# Altium project AATB.PrjPcb (part 1 of 2)
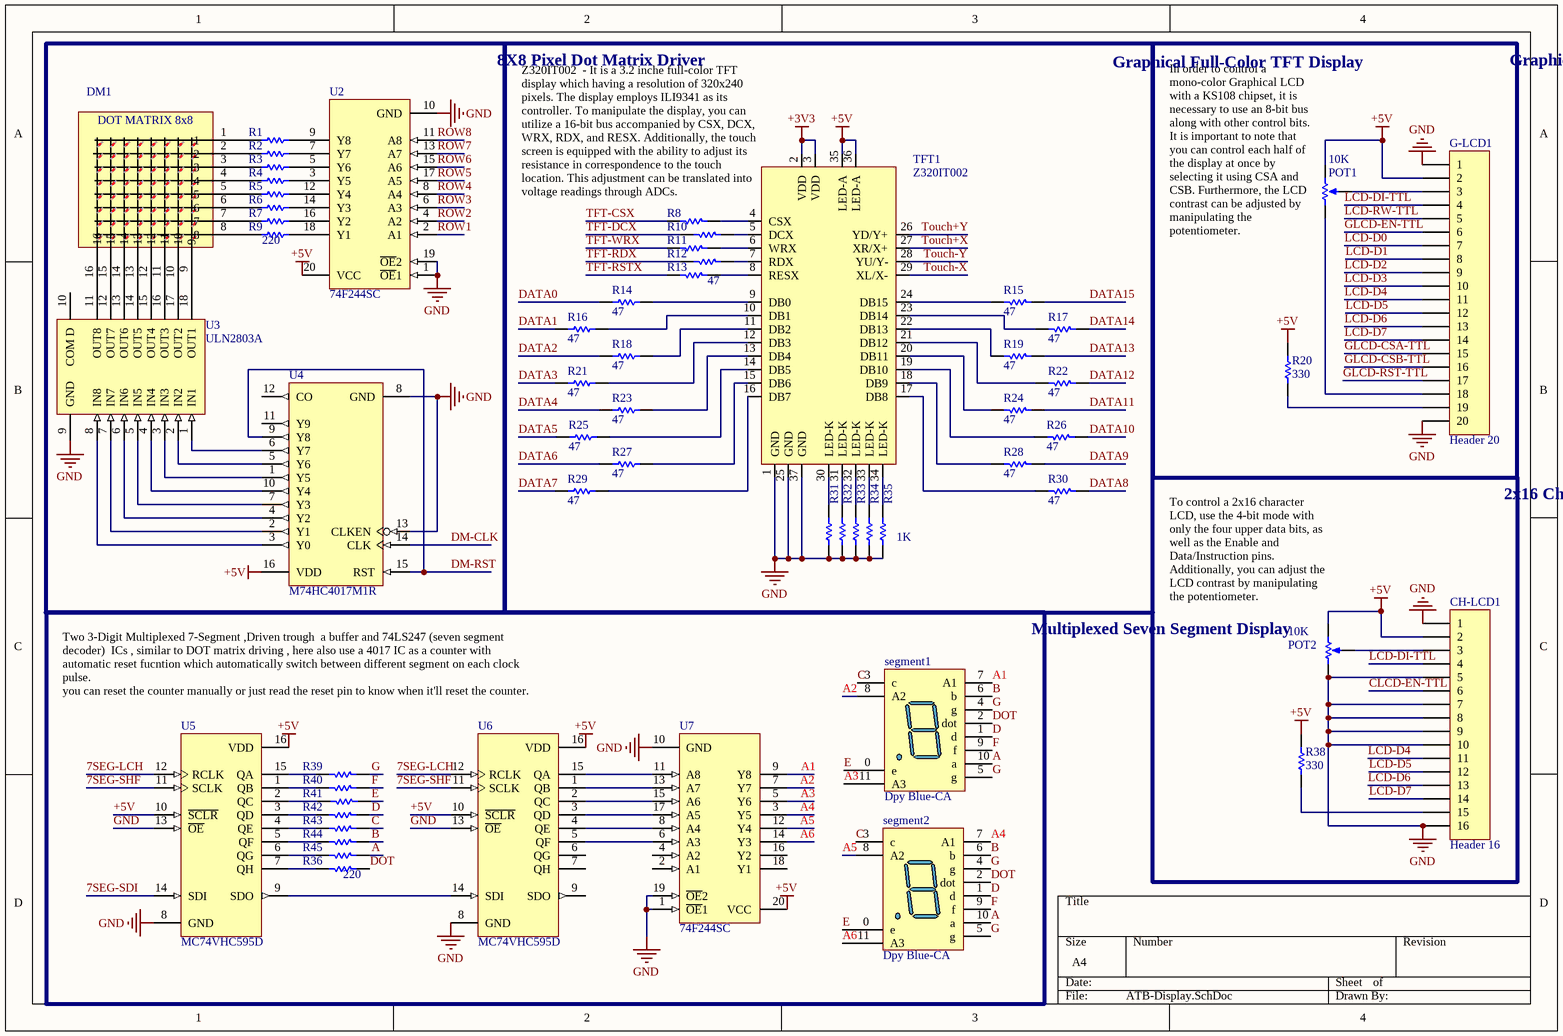
[diagram p0: ATB-Display.SchDoc]
6 sheets, 283 parts. Net scope: global (net labels, ports and power ports of the same name join across sheets).
Board file: AATB-V2.1.PcbDoc
Sheets:
  ATB-Display.SchDoc
  ATB-Power.SchDoc
  ATB-Ports.SchDoc
  ATB-Basics-PartA.SchDoc
  ATB-Basics-PartB.SchDoc
  AATB-V2.1.SchDoc

## Sheet ATB-Display.SchDoc
size A4

### Parts
(Parts that share a designator on the sheet are numbered #1, #2 ... from top to bottom, then left to right.)
CH-LCD1  Header 16  [2X16 LCD]
DM1  DOT-8x8-32X32mm  [8x8 LED MATRIX]  (value not drawn)
G-LCD1  Header 20  [LCD-128X64-ST7920]
POT1  value 10K  [VR5]  (hidden comment: RPot)
POT2  value 10K  [VR5]  (hidden comment: RPot)
R1  220  [SMD_R0805]  (value not drawn)
R2  220  [SMD_R0805]  (value not drawn)
R3  220  [SMD_R0805]  (value not drawn)
R4  220  [SMD_R0805]  (value not drawn)
R5  220  [SMD_R0805]  (value not drawn)
R6  220  [SMD_R0805]  (value not drawn)
R7  220  [SMD_R0805]  (value not drawn)
R8  47  [SMD_R0805]
R9  220  [SMD_R0805]
R10  47  [SMD_R0805]  (value not drawn)
R11  47  [SMD_R0805]  (value not drawn)
R12  47  [SMD_R0805]  (value not drawn)
R13  47  [SMD_R0805]  (value not drawn)
R14  47  [SMD_R0805]
R15  47  [SMD_R0805]
R16  47  [SMD_R0805]
R17  47  [SMD_R0805]
R18  47  [SMD_R0805]
R19  47  [SMD_R0805]
R20  330  [SMD_R1206]
R21  47  [SMD_R0805]
R22  47  [SMD_R0805]
R23  47  [SMD_R0805]
R24  47  [SMD_R0805]
R25  47  [SMD_R0805]
R26  47  [SMD_R0805]
R27  47  [SMD_R0805]
R28  47  [SMD_R0805]
R29  47  [SMD_R0805]
R30  47  [SMD_R0805]
R31  1K  [SMD_R0805]  (value not drawn)
R32  1K  [SMD_R0805]  (value not drawn)
R33  1K  [SMD_R0805]  (value not drawn)
R34  1K  [SMD_R0805]  (value not drawn)
R35  1K  [SMD_R0805]
R36  220  [SMD_R0805]  (value not drawn)
R38  330  [SMD_R1206]
R39  220  [SMD_R0805]  (value not drawn)
R40  220  [SMD_R0805]  (value not drawn)
R41  220  [SMD_R0805]  (value not drawn)
R42  220  [SMD_R0805]  (value not drawn)
R43  220  [SMD_R0805]  (value not drawn)
R44  220  [SMD_R0805]
R45#1  220  [SMD_R0805]  (value not drawn)
segment1  Dpy Blue-CA  [7 segment Diode]
segment2  Dpy Blue-CA  [7 segment Diode]
TFT1  Z320IT002  [N96 COLOR LCD]
U2  74F244SC  [751D-04_N]
U3  ULN2803A  [so18_n]
U4  M74HC4017M1R  [SO16_N]
U5  MC74VHC595D  [751B-05_N]
U6  MC74VHC595D  [751B-05_N]
U7  74F244SC  [751D-04_N]

### Blocks framed on the sheet
8X8 Pixel Dot Matrix Driver: DM1 R1-R7 R9 U2-U4
Graphical Full-Color TFT Display: R8 R10-R19 R21-R35 TFT1
Graphical Mono Color LCD: G-LCD1 POT1 R20
Multiplexed Seven Segment Display: R36 R39-R44 R45#1 segment1 segment2 U5-U7

### Nets
+3V3: TFT1.2(VDD) TFT1.3(VDD)
+5V: CH-LCD1.2 G-LCD1.2 POT1.2(BOT) POT2.2(BOT) R20.2 R38.2 TFT1.35(LED-A) TFT1.36(LED-A) U2.20(VCC) U4.16(VDD) U5.10(~{SCLR}) U5.16(VDD) U6.10(~{SCLR}) U6.16(VDD) U7.20(VCC)
GND: CH-LCD1.1 CH-LCD1.5 CH-LCD1.7 CH-LCD1.8 CH-LCD1.9 CH-LCD1.10 CH-LCD1.16 G-LCD1.1 G-LCD1.20 POT2.1(TOP) R31.2 R32.2 R33.2 R34.2 R35.2 TFT1.1(GND) TFT1.25(GND) TFT1.37(GND) U2.1(~{OE}1) U2.10(GND) U2.19(~{OE}2) U3.9(GND) U4.8(GND) U4.13(CLKEN) U5.8(GND) U5.13(~{OE}) U6.8(GND) U6.13(~{OE}) U7.1(~{OE}1) U7.10(GND) U7.19(~{OE}2)
7SEG-LCH: U5.12(RCLK) U6.12(RCLK)
7SEG-SDI: U5.14(SDI)
7SEG-SHF: U5.11(SCLK) U6.11(SCLK)
A: R45#1.1 segment1.10(a) segment2.10(a)
A1: segment1.7(A1) U7.9(Y8)
A2: segment1.8(A2) U7.7(Y7)
A3: segment1.11(A3) U7.5(Y6)
A4: segment2.7(A1) U7.3(Y5)
A5: segment2.8(A2) U7.12(Y4)
A6: segment2.11(A3) U7.14(Y3)
B: R44.2 segment1.6(b) segment2.6(b)
C: R43.2 segment1.3(c) segment2.3(c)
CLCD-EN-TTL: CH-LCD1.6
D: R42.2 segment1.1(d) segment2.1(d)
DATA0: R14.2
DATA1: R16.2
DATA2: R18.2
DATA3: R21.2
DATA4: R23.2
DATA5: R25.1
DATA6: R27.1
DATA7: R29.1
DATA8: R30.1
DATA9: R28.1
DATA10: R26.1
DATA11: R24.2
DATA12: R22.2
DATA13: R19.2
DATA14: R17.2
DATA15: R15.2
DM-CLK: U4.14(CLK)
DM-RST: U4.9(Y8) U4.15(RST)
DOT: R36.1 segment1.2(dot) segment2.2(dot)
E: R41.2 segment1.0(e) segment2.0(e)
F: R40.2 segment1.9(f) segment2.9(f)
G: R39.2 segment1.4(g) segment1.5(g) segment2.4(g) segment2.5(g)
GLCD-CSA-TTL: G-LCD1.15
GLCD-CSB-TTL: G-LCD1.16
GLCD-EN-TTL: G-LCD1.6
GLCD-RST-TTL: G-LCD1.17
LCD-D0: G-LCD1.7
LCD-D1: G-LCD1.8
LCD-D2: G-LCD1.9
LCD-D3: G-LCD1.10
LCD-D4: CH-LCD1.11 G-LCD1.11
LCD-D5: CH-LCD1.12 G-LCD1.12
LCD-D6: CH-LCD1.13 G-LCD1.13
LCD-D7: CH-LCD1.14 G-LCD1.14
LCD-DI-TTL: CH-LCD1.4 G-LCD1.4
LCD-RW-TTL: G-LCD1.5
ROW1: U2.2(A1)
ROW2: U2.4(A2)
ROW3: U2.6(A3)
ROW4: U2.8(A4)
ROW5: U2.17(A5)
ROW6: U2.15(A6)
ROW7: U2.13(A7)
ROW8: U2.11(A8)
TFT-CSX: R8.2
TFT-DCX: R10.2
TFT-RDX: R12.2
TFT-RSTX: R13.2
TFT-WRX: R11.2
Touch+X: TFT1.27(XR/X+)
Touch+Y: TFT1.26(YD/Y+)
Touch-X: TFT1.29(XL/X-)
Touch-Y: TFT1.28(YU/Y-)
NetCH-LCD1_3: CH-LCD1.3 POT2.3(TAP)
NetCH-LCD1_15: CH-LCD1.15 R38.1
NetDM1_1: DM1.1 R1.1
NetDM1_2: DM1.2 R2.1
NetDM1_3: DM1.3 R3.1
NetDM1_4: DM1.4 R4.1
NetDM1_5: DM1.5 R5.1
NetDM1_6: DM1.6 R6.1
NetDM1_7: DM1.7 R7.1
NetDM1_8: DM1.8 R9.1
NetDM1_9: DM1.9 U3.18(OUT1)
NetDM1_10: DM1.10 U3.17(OUT2)
NetDM1_11: DM1.11 U3.16(OUT3)
NetDM1_12: DM1.12 U3.15(OUT4)
NetDM1_13: DM1.13 U3.14(OUT5)
NetDM1_14: DM1.14 U3.13(OUT6)
NetDM1_15: DM1.15 U3.12(OUT7)
NetDM1_16: DM1.16 U3.11(OUT8)
NetG-LCD1_3: G-LCD1.3 POT1.3(TAP)
NetG-LCD1_18: G-LCD1.18 POT1.1(TOP)
NetG-LCD1_19: G-LCD1.19 R20.1
NetR1_2: R1.2 U2.9(Y8)
NetR2_2: R2.2 U2.7(Y7)
NetR3_2: R3.2 U2.5(Y6)
NetR4_2: R4.2 U2.3(Y5)
NetR5_2: R5.2 U2.12(Y4)
NetR6_2: R6.2 U2.14(Y3)
NetR7_2: R7.2 U2.16(Y2)
NetR8_1: R8.1 TFT1.4(CSX)
NetR9_2: R9.2 U2.18(Y1)
NetR10_1: R10.1 TFT1.5(DCX)
NetR11_1: R11.1 TFT1.6(WRX)
NetR12_1: R12.1 TFT1.7(RDX)
NetR13_1: R13.1 TFT1.8(RESX)
NetR14_1: R14.1 TFT1.9(DB0)
NetR15_1: R15.1 TFT1.24(DB15)
NetR16_1: R16.1 TFT1.10(DB1)
NetR17_1: R17.1 TFT1.23(DB14)
NetR18_1: R18.1 TFT1.11(DB2)
NetR19_1: R19.1 TFT1.22(DB13)
NetR21_1: R21.1 TFT1.12(DB3)
NetR22_1: R22.1 TFT1.21(DB12)
NetR23_1: R23.1 TFT1.13(DB4)
NetR24_1: R24.1 TFT1.20(DB11)
NetR25_2: R25.2 TFT1.14(DB5)
NetR26_2: R26.2 TFT1.19(DB10)
NetR27_2: R27.2 TFT1.15(DB6)
NetR28_2: R28.2 TFT1.18(DB9)
NetR29_2: R29.2 TFT1.16(DB7)
NetR30_2: R30.2 TFT1.17(DB8)
NetR31_1: R31.1 TFT1.30(LED-K)
NetR32_1: R32.1 TFT1.31(LED-K)
NetR33_1: R33.1 TFT1.32(LED-K)
NetR34_1: R34.1 TFT1.33(LED-K)
NetR35_1: R35.1 TFT1.34(LED-K)
NetR36_2: R36.2 U5.7(QH)
NetR39_1: R39.1 U5.15(QA)
NetR40_1: R40.1 U5.1(QB)
NetR41_1: R41.1 U5.2(QC)
NetR42_1: R42.1 U5.3(QD)
NetR43_1: R43.1 U5.4(QE)
NetR44_1: R44.1 U5.5(QF)
NetR45#1_2: R45#1.2 U5.6(QG)
NetU3_1: U3.1(IN1) U4.6(Y7)
NetU3_2: U3.2(IN2) U4.5(Y6)
NetU3_3: U3.3(IN3) U4.1(Y5)
NetU3_4: U3.4(IN4) U4.10(Y4)
NetU3_5: U3.5(IN5) U4.7(Y3)
NetU3_6: U3.6(IN6) U4.4(Y2)
NetU3_7: U3.7(IN7) U4.2(Y1)
NetU3_8: U3.8(IN8) U4.3(Y0)
NetU5_9: U5.9(SDO) U6.14(SDI)
NetU6_1: U6.1(QB) U7.13(A7)
NetU6_2: U6.2(QC) U7.15(A6)
NetU6_3: U6.3(QD) U7.17(A5)
NetU6_4: U6.4(QE) U7.8(A4)
NetU6_5: U6.5(QF) U7.6(A3)
NetU6_15: U6.15(QA) U7.11(A8)

Not connected (* = marked no-connect by the designer): U3 10(COM_D); U4 11(Y9) 12(CO); U6 6(QG) 7(QH) 9(SDO); U7 2(A1) 4(A2) 16(Y2) 18(Y1)

### Notes on the sheet
- (near TFT1) Z320IT002  - It is a 3.2 inche full-color TFT display which having a resolution of 320x240 pixels. The display employs ILI9341 as its controller. To manipulate the display, you can utilize a 16-bit bus accompanied by CSX, DCX, WRX, RDX, and RESX. Additionally, the touch screen is equipped with the ability to adjust its resistance in correspondence to the touch location. This adjustment can be translated into voltage readings through ADCs.
- (near POT1) In order to control a mono-color Graphical LCD with a KS108 chipset, it is necessary to use an 8-bit bus along with other control bits. It is important to note that you can control each half of the display at once by selecting it using CSA and CSB. Furthermore, the LCD contrast can be adjusted by manipulating the potentiometer.
- 2x16 Character LCD
- (near POT2) To control a 2x16 character LCD, use the 4-bit mode with only the four upper data bits, as well as the Enable and Data/Instruction pins. Additionally, you can adjust the LCD contrast by manipulating the potentiometer.
- Two 3-Digit Multiplexed 7-Segment ,Driven trough  a buffer and 74LS247 (seven segment decoder)  ICs , similar to DOT matrix driving , here also use a 4017 IC as a counter with automatic reset fucntion which automatically switch between different segment on each clock pulse.
  you can reset the counter manually or just read the reset pin to know when it'll reset the counter.
- (in symbol 8X8-DOT MATRIX LED) DOT MATRIX 8x8

### Library data of the parts
CH-LCD1 = Header 16: Header, 16-Pin; LatestRevisionDate: 17-Jul-2002; LatestRevisionNote: Re-released for DXP Platform.; Publisher: Altium Limited
DM1 = 8X8-DOT MATRIX LED
G-LCD1 = Header 20: Header, 20-Pin; LatestRevisionDate: 17-Jul-2002; LatestRevisionNote: Re-released for DXP Platform.; Publisher: Altium Limited
POT1 POT2 = RPot: Potentiometer; pin to pad: 1>3 2>1 3>2; Sim Note: Enter the Resistance value and the set point into parameter fields.; Set Position: 0.5; Published: 8-Jun-2000; LatestRevisionDate: 17-Jul-2002; LatestRevisionNote: Re-released for DXP Platform.; PackageReference: VR5; Publisher: Altium Limited
R1-R36 R38-R44 R45#1 = Res1: Resistor; Published: 8-Jun-2000; LatestRevisionDate: 17-Jul-2002; LatestRevisionNote: Re-released for DXP Platform.; PackageReference: AXIAL-0.3; Publisher: Altium Limited
  R1-R7 R9 R36 R39-R44 R45#1: Value: 220
  R8 R10-R19 R21-R30: Value: 47
  R20 R38: Value: 330
  R31-R35: Value: 1K
segment1 segment2 = Dpy Blue-CA: 14.2 mm General Purpose Blue 7-Segment Display: CA, RH DP, Gray Surface; Package Information: Latest Revision: 24-Sep-2002; Min. Intensity: 2020 ucd; Note: IF = 10 mA; Note: Pins 3 and 8 are redundant Anodes.; Datasheet: Latest Revision: 24-Sep-2002; Package Reference: H; Publisher: Altium Limited; Colour: Blue
TFT1 = TFT-Z320IT002: Size: 3.2 inches / Resolution: 240(H) X 320(V) RGB / Control Chip: ILI9341 / Display Color: Full-Color / Interface Type: 16bits Parallel interface
U2 U7 = 74F244SC: Octal Buffer/Line Driver with Tri-State Output; Published: 15-Apr-2002; LatestRevisionDate: 13-Apr-2006; LatestRevisionNote: IPC-7351 Footprint Added.; DatasheetVersion: May-1995; PackageVersion: 2000; PackageReference: M20B; Publisher: Altium Limited; PackageDescription: 20-Pin Small Outline Integrated Circuit 1.27 mm Pitch; Code_JEDEC: MS-013-AC; Code_IPC: SOIC127P1030-20; ComponentLink1Description: Manufacturer Link; ComponentLink1URL: http://www.national.com/; ComponentLink2Description: Datasheet; ComponentLink2URL: http://www.fairchildsemi.com/ds/74/74F244.pdf; ComponentLink3Description: URL Link1; ComponentLink3URL: http://www.fairchildsemi.com/pf/74/74F244.html
U3 = ULN2803A: Eight Darlington Array; Published: 8-Jun-2000; LatestRevisionDate: 06-Jun-2005; LatestRevisionNote: Stylized 3D Model Added.; DatasheetVersion: Sep-1997; PackageReference: DIP18; Publisher: Altium Limited; PackageDescription: DIP; 18 Leads; Row Spacing 7.62 mm; Pitch 2.54 mm; ComponentLink1Description: Manufacturer Link; ComponentLink1URL: http://www.st.com/; ComponentLink2Description: Datasheet; ComponentLink2URL: http://www.st.com/stonline/products/literature/ds/1536/uln2801a.pdf
U4 = M74HC4017M1R: Decade Counter/Divider; Published: 8-Jun-2000; LatestRevisionDate: 13-Apr-2006; LatestRevisionNote: IPC-7351 Footprint Added.; DatasheetVersion: Oct-1992; PackageVersion: May-1998; PackageReference: SO16; Publisher: Altium Limited; PackageDescription: 16-Pin Small Outline Integrated Circuit 1.27 mm Pitch; Code_IPC: SOIC127P600-16; ComponentLink1Description: Manufacturer Link; ComponentLink1URL: http://www.st.com/; ComponentLink2Description: Datasheet; ComponentLink2URL: http://www.st.com/stonline/products/literature/ds/1960/m74hc4017.pdf
U5 U6 = MC74VHC595D: 8-Bit 3-State Shift Register with Output Storage Register; ComponentAvailability: Not for New Design; Published: 15-Apr-2002; LatestRevisionDate: 13-Apr-2006; LatestRevisionNote: IPC-7351 Footprint Added.; DatasheetVersion: 1997; PackageVersion: Oct-1999; PackageReference: 751B-05; Publisher: Altium Limited; PackageDescription: 16-Pin Small Outline Integrated Circuit 1.27 mm Pitch; Code_JEDEC: MS-012-AC; Code_IPC: SOIC127P600-16; ComponentLink1Description: Manufacturer Link; ComponentLink1URL: http://www.onsemi.com/; ComponentLink2Description: Datasheet; ComponentLink2URL: http://www.onsemi.com/pub/Collateral/MC74VHC595-D.PDF

## Sheet ATB-Power.SchDoc
size A4
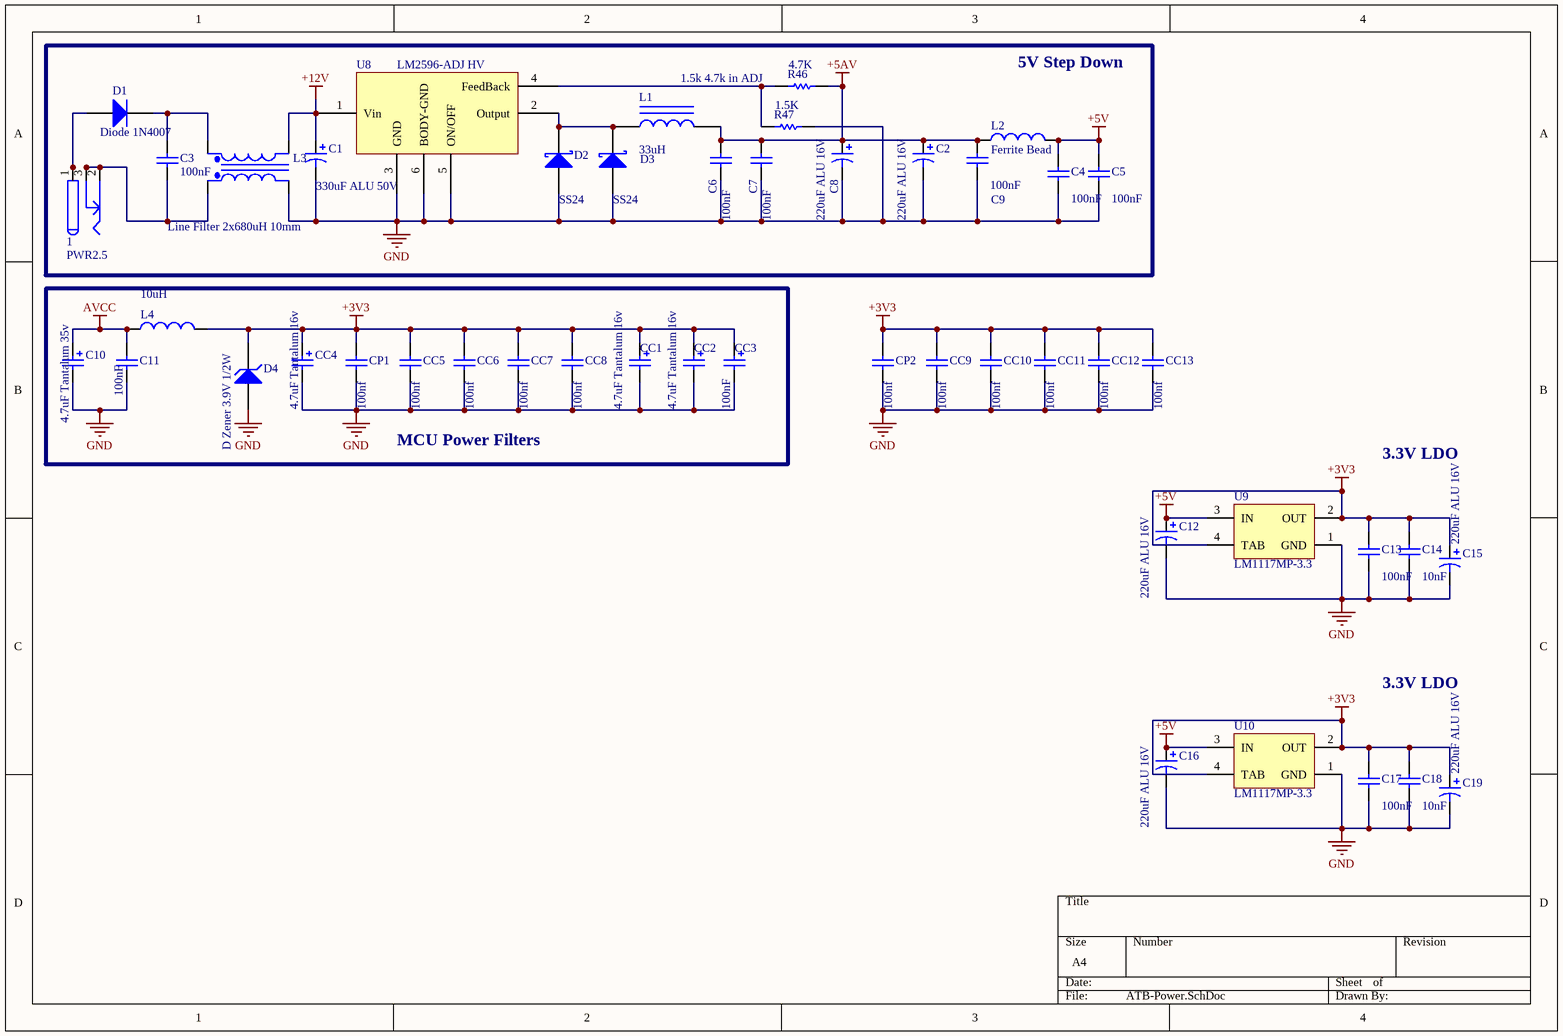
[diagram p1: ATB-Power.SchDoc]

### Parts
(Parts that share a designator on the sheet are numbered #1, #2 ... from top to bottom, then left to right.)
1  PWR2.5  [KLD-0202]
C1#1  330uF ALU 50V  [SMD_CAP_10X10]
C2#1  220uF ALU 16V  [SMD_CAP_6X6_B6]
C3#1  100nF  [SMD_C0805]
C4#1  100nF  [SMD_C0805]
C5#1  100nF  [SMD_C0805]
C6  100nF  [SMD_C0805]
C7  100nF  [SMD_C0805]
C8  220uF ALU 16V  [SMD_CAP_6X6_B6]
C9  100nF  [SMD_C0805]
C10  4.7uF Tantalum 35v  [SMD_C3528-P]
C11#1  100nF  [SMD_C0805]
C12  220uF ALU 16V  [SMD_CAP_6X6_B6]
C13  100nF  [SMD_C0805]
C14  10nF  [SMD_C0805]
C15  220uF ALU 16V  [SMD_CAP_6X6_B6]
C16  220uF ALU 16V  [SMD_CAP_6X6_B6]
C17  100nF  [SMD_C0805]
C18  10nF  [SMD_C0805]
C19  220uF ALU 16V  [SMD_CAP_6X6_B6]
CC1  4.7uF Tantalum 16v  [SMD_C3528-P]
CC2  4.7uF Tantalum 16v  [SMD_C3528-P]
CC3  100nF  [SMD_C0805]
CC4  4.7uF Tantalum 16v  [SMD_C3528-P]
CC5  100nf  [SMD_C0805]
CC6  100nf  [SMD_C0805]
CC7  100nf  [SMD_C0805]
CC8  100nf  [SMD_C0805]
CC9  100nf  [SMD_C0805]
CC10  100nf  [SMD_C0805]
CC11  100nf  [SMD_C0805]
CC12  100nf  [SMD_C0805]
CC13  100nf  [SMD_C0805]
CP1  100nf  [SMD_C0805]
CP2  100nf  [SMD_C0805]
D1  Diode 1N4007  [M7-4007]
D2  SS24  [D_SMA]
D3  SS24  [D_SMA]
D4  D Zener 3.9V 1/2W  [DL-35]
L1  33uH  [SMD_IND_12X12]
L2  Ferrite Bead  [SMD_C1206]
L3  Line Filter 2x680uH 10mm  [CN_FILTE]
L4  10uH  [6-0805_N]
R46#1  4.7K  [SMD_R0805]
R47#1  1.5K  [SMD_R0805]
U8  LM2596-ADJ HV  [SMD-5pin-reg]
U9  LM1117MP-3.3  [MP04A_N]
U10#1  LM1117MP-3.3  [MP04A_N]

### Blocks framed on the sheet
5V Step Down: 1 C1#1 C2#1 C3#1 C4#1 C5#1 C6-C9 D1-D3 L1-L3 R46#1 R47#1 U8
MCU Power Filters: C10 C11#1 CC1-CC8 CP1 D4 L4

### Nets
+3V3: C13.2 C14.2 C15.1 C17.2 C18.2 C19.1 CC1.1 CC2.1 CC3.1 CC4.1 CC5.1 CC6.1 CC7.1 CC8.1 CC9.1 CC10.1 CC11.1 CC12.1 CC13.1 CP1.1 CP2.1 D4.2(K) L4.2 U9.2(OUT) U9.4(TAB) U10#1.2(OUT) U10#1.4(TAB)
+5AV: C2#1.1 C6.2 C7.2 C8.1 C9.2 L1.2 L2.1 R46#1.2
+5V: C4#1.2 C5#1.2 C12.1 C16.1 L2.2 U9.3(IN) U10#1.3(IN)
+12V: C1#1.1 L3.4(Sec-) U8.1(Vin)
AVCC: C10.1 C11#1.1 L4.1
GND: C1#1.2 C2#1.2 C4#1.1 C5#1.1 C6.1 C7.1 C8.2 C9.1 C10.2 C11#1.2 C12.2 C13.1 C14.1 C15.2 C16.2 C17.1 C18.1 C19.2 CC1.2 CC2.2 CC3.2 CC4.2 CC5.2 CC6.2 CC7.2 CC8.2 CC9.2 CC10.2 CC11.2 CC12.2 CC13.2 CP1.2 CP2.2 D2.1(A) D3.1(A) D4.1(A) L3.2(Pri-) R47#1.1 U8.3(GND) U8.5(ON/OFF) U8.6(BODY-GND) U9.1(GND) U10#1.1(GND)
Net1_1: 1.1 1.1A 1.1B D1.1(A)
Net1_2: 1.2 1.2A 1.2B 1.3 1.3A 1.3B C3#1.1 L3.1(Pri+)
NetC3#1_2: C3#1.2 D1.2(K) L3.3(Sec+)
NetD2_2: D2.2(K) D3.2(K) L1.1 U8.2(Output)
NetR46#1_1: R46#1.1 R47#1.2 U8.4(FeedBack)

### Notes on the sheet
- (near R46#1) 1.5k 4.7k in ADJ
- 3.3V LDO

### Library data of the parts
1 = PWR2.5: Low Voltage Power Supply Connector; Published: 17-Dec-2003; DatasheetDocument: 09-May-2002; Publisher: Altium Limited; ComponentLink1Description: Manufacturer Link; ComponentLink1URL: http://domino.kycon.com/internet/Products.html
C1#1 = Cap Pol1: Polarized Capacitor (Radial); Published: 8-Jun-2000; LatestRevisionDate: 17-Jul-2002; LatestRevisionNote: Re-released for DXP Platform.; PackageReference: RB7.6-15; Publisher: Altium Limited; PackageDescription: Polarized Capacitor (Radial); 2 Leads; Value: 330uF
C2#1 C8 = Cap Pol1: Polarized Capacitor (Radial); Value: 100uF; Published: 8-Jun-2000; LatestRevisionDate: 17-Jul-2002; LatestRevisionNote: Re-released for DXP Platform.; PackageReference: RB7.6-15; Publisher: Altium Limited; PackageDescription: Polarized Capacitor (Radial); 2 Leads
C3#1 C4#1 C5#1 C6 C7 C9 C11#1 C13 C14 C17 C18 CC5-CC13 CP1 CP2 = Cap: Capacitor; Published: 8-Jun-2000; LatestRevisionDate: 17-Jul-2002; LatestRevisionNote: Re-released for DXP Platform.; PackageReference: RAD-0.3; Publisher: Altium Limited; PackageDescription: Radial Cap, Thru-Hole; 2 Leads; 0.3 in Pin Spacing
  C3#1 C4#1 C5#1 C6 C7 C9 C11#1 C13 C17 CC5-CC13 CP1 CP2: Value: 100nF
  C14 C18: Value: 10nF
C10 = Cap Pol2: Polarized Capacitor (Axial); Value: 1uF; Published: 8-Jun-2000; LatestRevisionDate: 17-Jul-2002; LatestRevisionNote: Re-released for DXP Platform.; PackageReference: POLAR0.8; Publisher: Altium Limited; PackageDescription: Polarized Capacitor; 2 Leads
C12 C15 C16 C19 = Cap Pol1: Polarized Capacitor (Radial); Value: 10uF; Published: 8-Jun-2000; LatestRevisionDate: 17-Jul-2002; LatestRevisionNote: Re-released for DXP Platform.; PackageReference: RB7.6-15; Publisher: Altium Limited; PackageDescription: Polarized Capacitor (Radial); 2 Leads
CC1-CC4 = Cap Pol2: Polarized Capacitor (Axial); Published: 8-Jun-2000; LatestRevisionDate: 17-Jul-2002; LatestRevisionNote: Re-released for DXP Platform.; PackageReference: POLAR0.8; Publisher: Altium Limited; PackageDescription: Polarized Capacitor; 2 Leads
  CC1 CC2 CC4: Value: 4.7uF
  CC3: Value: 100nF
D1 = Diode 1N4007: 1 Amp General Purpose Rectifier; Published: 8-Jun-2000; LatestRevisionDate: 17-Jul-2002; LatestRevisionNote: Re-released for DXP Platform.; DatasheetVersion: 1998; PackageVersion: Aug-1999; PackageReference: DO-41; Publisher: Altium Limited; PackageDescription: Diode, Axial; Body 5.2 x 2.7 mm (LxDia. max), Lead Dia. 0.86 mm (max); Code_JEDEC: DO-204-AL; ComponentLink1Description: Manufacturer Link; ComponentLink1URL: http://www.fairchildsemi.com/; ComponentLink2Description: Datasheet; ComponentLink2URL: http://www.fairchildsemi.com/ds/1N%2F1N4001.pdf
D2 D3 = D Schottky: Schottky Diode; Published: 8-Jun-2000; LatestRevisionDate: 17-Jul-2002; LatestRevisionNote: Re-released for DXP Platform.; PackageReference: SMB; Publisher: Altium Limited; PackageDescription: DO-214-AA/SMB; 2 C-Bend Leads; Body 5.3 x 3.6 mm, inc. leads (LxW); Code_JEDEC: DO-214-AA
D4 = D Zener: Zener Diode; Published: 8-Jun-2000; LatestRevisionDate: 17-Jul-2002; LatestRevisionNote: Re-released for DXP Platform.; PackageReference: DIODE-0.7; Publisher: Altium Limited; PackageDescription: Diode, Thru-Hole; 2 Leads; 0.7 in Pin Spacing
L1 = Inductor Iron: Magnetic-Core Inductor; Published: 24-Mar-1999; LatestRevisionDate: 17-Jul-2002; LatestRevisionNote: Re-released for DXP Platform.; PackageReference: AXIAL-0.9; Publisher: Altium Limited; PackageDescription: Axial Device, Thru-Hole; 2 Leads; 0.9 in Pin Spacing; Value: 33uH
L2 = Inductor: Code_IEC: 1005; Value: 10mH; Published: 8-Jun-2000; LatestRevisionDate: 29-May-2009; LatestRevisionNote: IPC-7351 Footprint Added.; PackageReference: 0402-A; Publisher: Altium Limited; PackageDescription: Chip Inductor; Code_JEITA: 0402
L3 = Trans Eq: Transformer (Equivalent Circuit Model); pin to pad: 1>4 4>1; Published: 8-Jun-2000; LatestRevisionDate: 17-Jul-2002; LatestRevisionNote: Re-released for DXP Platform.; PackageReference: TRF_4; Publisher: Altium Limited; PackageDescription: Transformer; 4 Leads
L4 = Inductor: Code_IEC: 1005; Published: 8-Jun-2000; LatestRevisionDate: 29-May-2009; LatestRevisionNote: IPC-7351 Footprint Added.; PackageReference: 0402-A; Publisher: Altium Limited; PackageDescription: Chip Inductor; Code_JEITA: 0402; Value: 10uH
R46#1 R47#1 = Res1: Resistor; Published: 8-Jun-2000; LatestRevisionDate: 17-Jul-2002; LatestRevisionNote: Re-released for DXP Platform.; PackageReference: AXIAL-0.3; Publisher: Altium Limited; PackageDescription: Axial Device, Thru-Hole; 2 Leads; 0.3 in Pin Spacing
  R46#1: Value: 4.7K
  R47#1: Value: 1.5K
U8 = LM2596-5v
U9 U10#1 = LM1117MP-3.3: 800mA Low-Dropout Linear Regulator, 4-pin SOT-223; Manufacturer: National Semiconductor; PackageTopMarking: XYTT*N05A; PowerWise: N; CompType: LDO IC; Published: 4-Dec-2008; DatasheetVersion: Apr-2006; PackageVersion: revB, Apr-2003; PackageReference: MP04A; Publisher: Altium Limited; PackageDescription: Molded SOT-223, 6.50 x 3.56 x 1.6mm Body, 4 Lead, 2.3mm Pitch; Supplier 1: Farnell; Supplier Part Number 1: 9778195; Supplier 2: Farnell; Supplier Part Number 2: 9778195RL; PartNumber: LM1117MP-3.3; RoHS: N; PinCount: 4; Code_JEDEC: TO-261-AA; Code_IPC: SOT223-4; ComponentLink1Description: LM1117 Datasheet; ComponentLink1URL: http://www.national.com/ds/LM/LM1117.pdf; ComponentLink2Description: LM1117 Web Page; ComponentLink2URL: http://www.national.com/pf/LM/LM1117.html; ComponentLink3Description: MP04A Package Page; ComponentLink3URL: http://www.national.com/packaging/folders/mp04a.html

## Sheet ATB-Ports.SchDoc
size A4
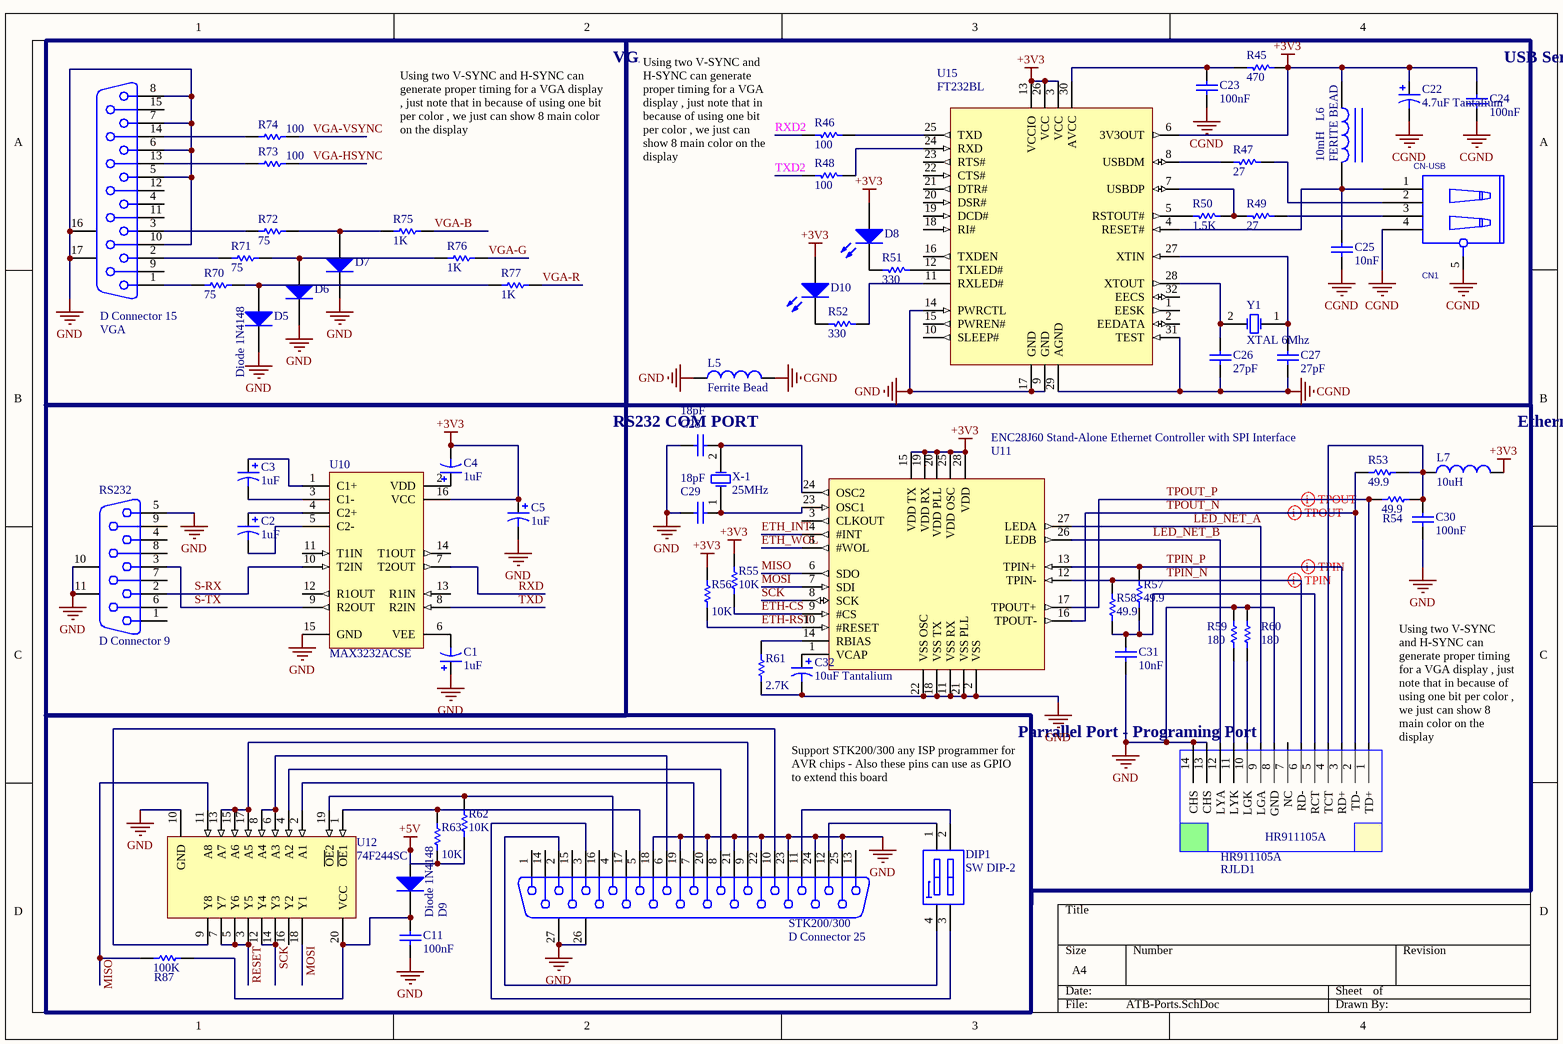
[diagram p2: ATB-Ports.SchDoc]

### Parts
(Parts that share a designator on the sheet are numbered #1, #2 ... from top to bottom, then left to right.)
C1#2  1uF  [SMD_C0805]
C2#2  1uF  [SMD_C0805]
C3#2  1uF  [SMD_C0805]
C4#2  1uF  [SMD_C0805]
C5#2  1uF  [SMD_C0805]
C11#2  100nF  [SMD_R0805]
C22  4.7uF Tantalium  [SMD_C3528-P]
C23  100nF  [SMD_C0805]
C24  100nF  [SMD_C0805]
C25  10nF  [SMD_C0805]
C26  27pF  [SMD_C0805]
C27  27pF  [SMD_C0805]
C28  18pF  [SMD_C0805]
C29  18pF  [SMD_C0805]
C30  100nF  [SMD_C0805]
C31  10nF  [SMD_C0805]
C32  10uF Tantalium  [SMD_C3528-P]
CN1  CN-USB  [USB-FEMALE]
D5  Diode 1N4148  [DL-35]
D6  Diode 1N4148  [DL-35]  (value not drawn)
D7  Diode 1N4148  [DL-35]  (value not drawn)
D8  LED0  [LED_0603_1608]  (value not drawn)
D9  Diode 1N4148  [DL-35]
D10  LED0  [LED_0603_1608]  (value not drawn)
DIP1  SW DIP-2  [DIP-4]
L5  Ferrite Bead  [SMD_C1206]
L6  FERITE BEAD  value 10mH  [SMD_R1206]
L7  10uH  [SMD_R0805]
R45#2  470  [SMD_R0805]
R46#2  100  [SMD_R0805]
R47#2  27  [SMD_R0805]
R48  100  [SMD_R0805]
R49  27  [SMD_R0805]
R50  1.5K  [SMD_R0805]
R51  330  [SMD_R0805]
R52  330  [SMD_R0805]
R53  49.9  [SMD_R0805]
R54  49.9  [SMD_R0805]
R55  10K  [SMD_R0805]
R56  10K  [SMD_R0805]
R57  49.9  [SMD_R0805]
R58  49.9  [SMD_R0805]
R59  180  [SMD_R0805]
R60  180  [SMD_R0805]
R61  2.7K  [SMD_R0805]
R62  10K  [SMD_R0805]
R63  10K  [SMD_R0805]
R70  75  [SMD_R0805]
R71  75  [SMD_R0805]
R72  75  [SMD_R0805]
R73  100  [SMD_R0805]
R74#1  100  [SMD_R0805]
R75#1  1K  [SMD_R0805]
R76#1  1K  [SMD_R0805]
R77#1  1K  [SMD_R0805]
R87#1  100K  [SMD_R0805]
RJLD1  HR911105A  [RJ45&LED]
RS232  D Connector 9  [DSUB1.385-2H9]
STK200/300  D Connector 25  [DSUB1.385-2H25A]
U10#2  MAX3232ACSE  [NSO16_N]
U11  ENC28J60 Stand-Alone Ethernet Controller with SPI Interface  [SOIC127P1030X224-28M]
U12  74F244SC  [M20B_N]
U15  FT232BL  [LQFP-32_N]
VGA  D Connector 15  [D-Sub-H.D-Right-15]
X-1  25MHz  [XTALL-SMD]
Y1  XTAL 6Mhz  [XTALL]

### Blocks framed on the sheet
VGA PORT: D5-D7 R70-R73 R74#1 R75#1 R76#1 R77#1 VGA
USB Serial PORT: C22-C27 CN1 D8 D10 L5 L6 R45#2 R46#2 R47#2 R48-R52 U15 Y1
RS232 COM PORT: C1#2 C2#2 C3#2 C4#2 C5#2 RS232 U10#2
Parrallel Port - Programing Port: C11#2 D9 DIP1 R62 R63 R87#1 STK200/300 U12

### Nets
+3V3: C4#2.2 C5#2.1 C22.1 C24.1 D8.1(A) D10.1(A) L6.2 L7.2 R45#2.1 R55.2 R56.2 U10#2.16(VCC) U11.15(VDD_TX) U11.19(VDD_RX) U11.20(VDD_PLL) U11.25(VDD_OSC) U11.28(VDD) U15.3(VCC) U15.6(3V3OUT) U15.13(VCCIO) U15.26(VCC)
+5V: D9.1(A) R62.1 R63.1
CGND: C22.2 C23.1 C24.2 C25.1 C26.1 C27.1 CN1.4 CN1.5 L5.2 U15.29(AGND) U15.31(TEST)
GND: C1#2.1 C5#2.2 C11#2.1 C28.1 C29.1 C30.2 C31.1 C32.2 D5.2(K) D6.2(K) D7.2(K) L5.1 R59.1 R60.1 R61.1 RJLD1.8(GND) RJLD1.13(CHS) RJLD1.14(CHS) RS232.5 RS232.10(MH1) RS232.11(MH2) STK200/300.18 STK200/300.19 STK200/300.20 STK200/300.21 STK200/300.22 STK200/300.23 STK200/300.24 STK200/300.25 STK200/300.26(MH1) STK200/300.27(MH2) U10#2.15(GND) U11.2(VSS) U11.11(VSS_RX) U11.18(VSS_TX) U11.21(VSS_PLL) U11.22(VSS_OSC) U12.10(GND) U15.9(GND) U15.14(PWRCTL) U15.17(GND) VGA.5 VGA.6 VGA.7 VGA.8 VGA.10 VGA.16(MH1) VGA.17(MH2)
ETH-CS: R55.1 U11.9(#CS)
ETH-RST: R56.1 U11.10(#RESET)
ETH_INT: U11.4(#INT)
ETH_WOL: U11.5(#WOL)
LED_NET_A: RJLD1.9(LGA) U11.27(LEDA)
LED_NET_B: RJLD1.12(LYA) U11.26(LEDB)
MISO: R87#1.1 U11.6(SDO) U12.11(A8)
MOSI: U11.7(SDI) U12.18(Y1)
RESET: U12.3(Y5) U12.5(Y6) U12.7(Y7)
RXD: U10#2.7(T2OUT)
RXD2: R46#2.2
S-RX: RS232.2 U10#2.10(T2IN)
S-TX: RS232.3 U10#2.9(R2OUT)
SCK: U11.8(SCK) U12.12(Y4) U12.14(Y3)
TPIN_N: R58.2 RJLD1.6(RD-) U11.12(TPIN-)
TPIN_P: R57.2 RJLD1.3(RD+) U11.13(TPIN+)
TPOUT_N: R53.1 RJLD1.2(TD-) U11.16(TPOUT-)
TPOUT_P: R54.1 RJLD1.1(TD+) U11.17(TPOUT+)
TXD: U10#2.8(R2IN)
TXD2: R48.1
VGA-B: R75#1.2
VGA-G: R76#1.2
VGA-HSYNC: R73.2
VGA-R: R77#1.2
VGA-VSYNC: R74#1.2
NetC1#2_2: C1#2.2 U10#2.6(VEE)
NetC2#2_1: C2#2.1 U10#2.4(C2+)
NetC2#2_2: C2#2.2 U10#2.5(C2-)
NetC3#2_1: C3#2.1 U10#2.1(C1+)
NetC3#2_2: C3#2.2 U10#2.3(C1-)
NetC4#2_1: C4#2.1 U10#2.2(VDD)
NetC11#2_2: C11#2.2 D9.2(K) R87#1.2 U12.20(VCC)
NetC23_2: C23.2 R45#2.2 U15.30(AVCC)
NetC25_2: C25.2 CN1.1 L6.1 U15.4(RESET#)
NetC26_2: C26.2 U15.28(XTOUT) Y1.2(OSC2)
NetC27_2: C27.2 U15.27(XTIN) Y1.1(OSC1)
NetC28_2: C28.2 U11.24(OSC2) X-1.2(OSC2)
NetC29_2: C29.2 U11.23(OSC1) X-1.1(OSC1)
NetC30_1: C30.1 L7.1 R53.2 R54.2 RJLD1.4(TCT)
NetC31_2: C31.2 R57.1 R58.1 RJLD1.5(RCT)
NetC32_1: C32.1 U11.1(VCAP)
NetCN1_2: CN1.2 R47#2.1
NetCN1_3: CN1.3 R49.1
NetD5_1: D5.1(A) R70.2 R77#1.1
NetD6_1: D6.1(A) R71.2 R76#1.1
NetD7_1: D7.1(A) R72.2 R75#1.1
NetD8_2: D8.2(K) R51.2
NetD10_2: D10.2(K) R52.2
NetDIP1_1: DIP1.1(A1) STK200/300.12
NetDIP1_2: DIP1.2(A2) STK200/300.11
NetDIP1_3: DIP1.3(B2) STK200/300.3
NetDIP1_4: DIP1.4(B1) STK200/300.2
NetR46#2_1: R46#2.1 U15.25(TXD)
NetR47#2_2: R47#2.2 U15.8(USBDM)
NetR48_2: R48.2 U15.24(RXD)
NetR49_2: R49.2 R50.1 U15.7(USBDP)
NetR50_2: R50.2 U15.5(RSTOUT#)
NetR51_1: R51.1 U15.12(TXLED#)
NetR52_1: R52.1 U15.11(RXLED#)
NetR59_2: R59.2 RJLD1.11(LYK)
NetR60_2: R60.2 RJLD1.10(LGK)
NetR61_2: R61.2 U11.14(RBIAS)
NetR62_2: R62.2 STK200/300.4 U12.19(~{OE}2)
NetR63_2: R63.2 STK200/300.5 U12.1(~{OE}1)
NetR70_1: R70.1 VGA.1
NetR71_1: R71.1 VGA.2
NetR72_1: R72.1 VGA.3
NetR73_1: R73.1 VGA.13
NetR74#1_1: R74#1.1 VGA.14
NetSTK200/300_6: STK200/300.6 U12.6(A3) U12.8(A4)
NetSTK200/300_7: STK200/300.7 U12.2(A1)
NetSTK200/300_8: STK200/300.8 U12.4(A2)
NetSTK200/300_9: STK200/300.9 U12.13(A7) U12.15(A6) U12.17(A5)
NetSTK200/300_10: STK200/300.10 U12.9(Y8)

Not connected (* = marked no-connect by the designer): RJLD1 7(NC); RS232 1 4 6 7 8 9; STK200/300 1 13 14 15 16 17; U10#2 11(T1IN) 12(R1OUT) 13(R1IN) 14(T1OUT); U11 3(CLKOUT); U12 16(Y2); U15 1(EESK) 2(EEDATA) 10(SLEEP#) 15(PWREN#) 16(TXDEN) 18(RI#) 19(DCD#) 20(DSR#) 21(DTR#) 22(CTS#) 23(RTS#) 32(EECS); VGA 4 9 11 12 15

### Layout directives
differential pair: TPIN_N, TPIN_P, TPOUT_N, TPOUT_P

### Notes on the sheet
- Using two V-SYNC and H-SYNC can generate proper timing for a VGA display , just note that in because of using one bit per color , we just can show 8 main color on the display
- Ethernet PORT
- Support STK200/300 any ISP programmer for AVR chips - Also these pins can use as GPIO to extend this board
- (near RJLD1) Using two V-SYNC and H-SYNC can generate proper timing for a VGA display , just note that in because of using one bit per color , we just can show 8 main color on the display

### Library data of the parts
C1#2 C2#2 C3#2 C4#2 C5#2 C22 C32 = Cap Pol1: Polarized Capacitor (Radial); Published: 8-Jun-2000; LatestRevisionDate: 17-Jul-2002; LatestRevisionNote: Re-released for DXP Platform.; PackageReference: RB7.6-15; Publisher: Altium Limited
  C1#2 C2#2 C3#2 C4#2 C5#2: Value: 1uF
  C22: PackageDescription: Polarized Capacitor (Radial); 2 Leads; Value: 4.7uF
  C32: Value: 10uF
C11#2 C23-C31 = Cap: Capacitor; Published: 8-Jun-2000; LatestRevisionDate: 17-Jul-2002; LatestRevisionNote: Re-released for DXP Platform.; PackageReference: RAD-0.3; Publisher: Altium Limited
  C11#2 C30: Value: 100nF
  C23 C24: PackageDescription: Radial Cap, Thru-Hole; 2 Leads; 0.3 in Pin Spacing; Value: 100nF
  C25: PackageDescription: Radial Cap, Thru-Hole; 2 Leads; 0.3 in Pin Spacing; Value: 10nF
  C26 C27: PackageDescription: Radial Cap, Thru-Hole; 2 Leads; 0.3 in Pin Spacing; Value: 27pF
  C28 C29: Value: 18pF
  C31: Value: 10nF
CN1 = CN-USB: Right: 60; Bottom: 60
D5-D7 D9 = Diode 1N4148: High Conductance Fast Diode; Published: 8-Jun-2000; LatestRevisionDate: 17-Jul-2002; LatestRevisionNote: Re-released for DXP Platform.; DatasheetDocument: 1997; PackageReference: DO-35; Publisher: Altium Limited; Code_JEDEC: DO-204-AH; ComponentLink1Description: Manufacturer Link; ComponentLink1URL: http://www.fairchildsemi.com/; ComponentLink2Description: Datasheet; ComponentLink2URL: http://www.fairchildsemi.com/ds/1N%2F1N4148.pdf
D8 D10 = LED0: Typical INFRARED GaAs LED; Published: 8-Jun-2000; LatestRevisionDate: 08-Jul-2005; LatestRevisionNote: Mech Layer 1 removed.; PackageReference: LED-0; Publisher: Altium Limited; PackageDescription: LED; 2 Leads
DIP1 = SW DIP-2: DIP Switch, 2 Position, SPST; Published: 24-Mar-1999; LatestRevisionDate: 17-Jul-2002; LatestRevisionNote: Re-released for DXP Platform.; PackageReference: DIP-4; Publisher: Altium Limited
L5 = Inductor: Code_IEC: 1005; Value: 10mH; Published: 8-Jun-2000; LatestRevisionDate: 29-May-2009; LatestRevisionNote: IPC-7351 Footprint Added.; PackageReference: 0402-A; Publisher: Altium Limited; PackageDescription: Chip Inductor; Code_JEITA: 0402
L6 = Inductor Iron: Magnetic-Core Inductor; Published: 24-Mar-1999; LatestRevisionDate: 17-Jul-2002; LatestRevisionNote: Re-released for DXP Platform.; PackageReference: AXIAL-0.9; Publisher: Altium Limited; PackageDescription: Axial Device, Thru-Hole; 2 Leads; 0.9 in Pin Spacing
L7 = Inductor: Code_IEC: 1005; Published: 8-Jun-2000; LatestRevisionDate: 17-Jul-2002; LatestRevisionNote: Re-released for DXP Platform.; PackageReference: 0402-A; Publisher: Altium Limited; Code_JEITA: 0402; Value: 10uH
R45#2 R46#2 R47#2 R48-R50 R53-R63 R70-R73 R74#1 R75#1 R76#1 R77#1 R87#1 = Res1: Resistor; Published: 8-Jun-2000; LatestRevisionDate: 17-Jul-2002; LatestRevisionNote: Re-released for DXP Platform.; PackageReference: AXIAL-0.3; Publisher: Altium Limited
  R45#2: PackageDescription: Axial Device, Thru-Hole; 2 Leads; 0.3 in Pin Spacing; Value: 470
  R46#2 R48: PackageDescription: Axial Device, Thru-Hole; 2 Leads; 0.3 in Pin Spacing; Value: 100
  R47#2 R49: PackageDescription: Axial Device, Thru-Hole; 2 Leads; 0.3 in Pin Spacing; Value: 27
  R50: PackageDescription: Axial Device, Thru-Hole; 2 Leads; 0.3 in Pin Spacing; Value: 1.5K
  R53 R54 R57 R58: Value: 49.9
  R55 R56 R62 R63: Value: 10K
  R59 R60: Value: 180
  R61: Value: 2.7K
  R70-R72: Value: 75
  R73 R74#1: Value: 100
  R75#1 R76#1 R77#1: Value: 1K
  R87#1: Value: 100K
R51 R52 = Res1: Resistor; Value: 220; Published: 8-Jun-2000; LatestRevisionDate: 17-Jul-2002; LatestRevisionNote: Re-released for DXP Platform.; PackageReference: AXIAL-0.3; Publisher: Altium Limited; PackageDescription: Axial Device, Thru-Hole; 2 Leads; 0.3 in Pin Spacing
RJLD1 = RJLD043TC1
RS232 = D Connector 9: Receptacle Assembly, 9 Position, Right Angle; PackageDocument: O; Positions: 9; Published: 15-Jun-2001; LatestRevisionDate: 17-Jul-2002; LatestRevisionNote: Re-released for DXP Platform.; DatasheetDocument: 1-Sep-1999; PackageReference: 788750; Publisher: Altium Limited; Orientation: Right Angle; Gender: Receptacle
STK200/300 = D Connector 25: Receptacle Assembly, 25 Position, Right Angle; PackageDocument: U; Positions: 25; Published: 15-Jun-2001; LatestRevisionDate: 17-Jul-2002; LatestRevisionNote: Re-released for DXP Platform.; DatasheetDocument: 19-Mar-1999; PackageReference: 787202; Publisher: Altium Limited; Orientation: Right Angle; Gender: Receptacle
U10#2 = MAX232ACSE: +5V Powered, Multi-Channel RS-232 Driver/Receiver; Published: 16-Jan-2001; LatestRevisionDate: 13-Apr-2006; LatestRevisionNote: IPC-7351 Footprint Added.; PackageReference: NSO16; Publisher: Altium Limited; PackageDescription: 16-Pin Small Outline Integrated Circuit 1.27 mm Pitch; Code_JEDEC: MS-012-AC; Code_IPC: SOIC127P600-16; ComponentLink1Description: Manufacturer Link; ComponentLink1URL: http://www.maxim-ic.com/; ComponentLink2Description: Datasheet; ComponentLink2URL: http://pdfserv.maxim-ic.com/en/ds/MAX220-MAX249.pdf
U11 = ENC29J60
U12 = 74F244SC: as U2 on sheet ATB-Display; Published: 15-Apr-2002; LatestRevisionDate: 13-Apr-2006; LatestRevisionNote: IPC-7351 Footprint Added.; DatasheetVersion: May-1995; PackageVersion: 2000; PackageReference: M20B; Publisher: Altium Limited; PackageDescription: 20-Pin Small Outline Integrated Circuit 1.27 mm Pitch; Code_JEDEC: MS-013-AC; Code_IPC: SOIC127P1030-20; ComponentLink1Description: Manufacturer Link; ComponentLink1URL: http://www.national.com/; ComponentLink2Description: Datasheet; ComponentLink2URL: http://www.fairchildsemi.com/ds/74/74F244.pdf; ComponentLink3Description: URL Link1; ComponentLink3URL: http://www.fairchildsemi.com/pf/74/74F244.html
U15 = FT232BL: USB UART Asynchronous Serial Data Transfer Chip, LQFP-32, Pb-Free; Published: 6-Oct-2005; LatestRevisionDate: 13-Apr-2006; LatestRevisionNote: IPC-7351 Footprint Added.; DatasheetVersion: ver 1.8, Dec-2005; PackageVersion: 2004; PackageReference: LQFP-32; Publisher: Altium Limited; PackageDescription: 32-Pin Thin Quad Flat Pack 0.8 mm Pitch; ComponentLink1Description: Manufacturer Link; ComponentLink1URL: http://www.ftdichip.com/Products/ICs/FT232B.htm; ComponentLink2Description: Datasheet; ComponentLink2URL: http://www.ftdichip.com/Support/Documents/DataSheets/ICs/DS_FT232BL.pdf
VGA = D Connector 15: Receptacle Assembly, 15 Position, Right Angle; PackageDocument: O; Positions: 15; Published: 15-Jun-2001; LatestRevisionDate: 17-Jul-2002; LatestRevisionNote: Re-released for DXP Platform.; DatasheetDocument: 1-Sep-99; PackageReference: 788757; Publisher: Altium Limited; Orientation: Right Angle; Gender: Receptacle
X-1 Y1 = XTAL: Crystal Oscillator; Published: 8-Jun-2000; LatestRevisionDate: 17-Jul-2002; LatestRevisionNote: Re-released for DXP Platform.; PackageReference: R38; Publisher: Altium Limited
  Y1: PackageDescription: Crystal, Thru-Hole; 2 Leads; Body 3.1 x 8.2 mm (Dia.xH)

## Sheet ATB-Basics-PartA.SchDoc
size A4
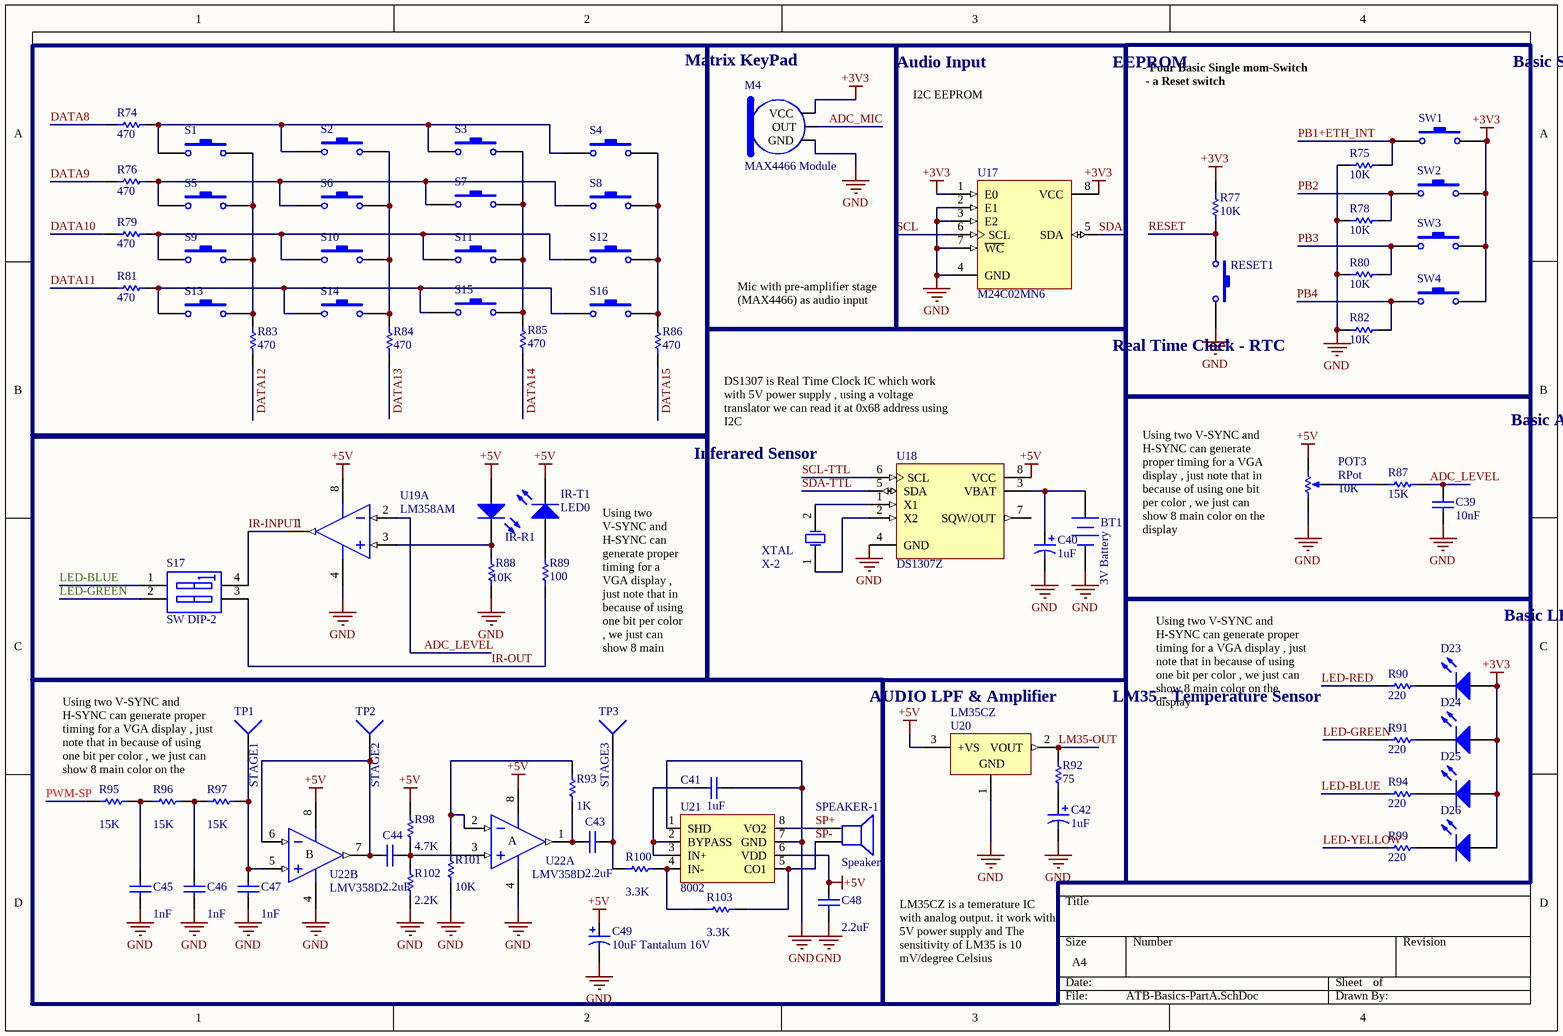
[diagram p3: ATB-Basics-PartA.SchDoc]

### Parts
(Parts that share a designator on the sheet are numbered #1, #2 ... from top to bottom, then left to right.)
BT1  3V Battery  [BAT-3V]
C39  10nF  [SMD_R0805]
C40  1uF  [SMD_C0805]
C41  1uF  [SMD_C0805]
C42  1uF  [SMD_C0805]
C43  2.2uF  [SMD_C0805]
C44  2.2uF  [SMD_C0805]
C45  1nF  [SMD_C0805]
C46  1nF  [SMD_C0805]
C47  1nF  [SMD_C0805]
C48  2.2uF  [SMD_C0805]
C49  10uF Tantalum 16V  [SMD_C3528-P]
D23  LED0  [3.5X2.8X1.9]  (value not drawn)
D24  LED0  [3.5X2.8X1.9]  (value not drawn)
D25  LED0  [3.5X2.8X1.9]  (value not drawn)
D26  LED0  [3.5X2.8X1.9]  (value not drawn)
IR-R1  (no value)  [LED-0]
IR-T1  LED0  [LED-0]
M4  MAX4466 Module  [MAX4466-Module]
POT3  RPot  value 10K  [volom]
R74#2  470  [SMD_R0805]
R75#2  10K  [SMD_R0805]
R76#2  470  [SMD_R0805]
R77#2  10K  [SMD_R0805]
R78  10K  [SMD_R0805]
R79  470  [SMD_R0805]
R80  10K  [SMD_R0805]
R81  470  [SMD_R0805]
R82  10K  [SMD_R0805]
R83  470  [SMD_R0805]
R84  470  [SMD_R0805]
R85  470  [SMD_R0805]
R86  470  [SMD_R0805]
R87#2  15K  [SMD_R0805]
R88  10K  [SMD_R0805]
R89  100  [SMD_R0805]
R90  220  [SMD_R0805]
R91  220  [SMD_R0805]
R92  75  [SMD_R0805]
R93  1K  [SMD_R0805]
R94  220  [SMD_R0805]
R95  15K  [SMD_R0805]
R96  15K  [SMD_R0805]
R97  15K  [SMD_R0805]
R98  4.7K  [SMD_R0805]
R99  220  [SMD_R0805]
R100  3.3K  [SMD_R0805]
R101  10K  [SMD_R0805]
R102  2.2K  [SMD_R0805]
R103  3.3K  [SMD_R0805]
RESET1  SW-PB  [mom-sw]  (value not drawn)
S1  SW-PB  [mom-sw]  (value not drawn)
S2  SW-PB  [mom-sw]  (value not drawn)
S3  SW-PB  [mom-sw]  (value not drawn)
S4  SW-PB  [mom-sw]  (value not drawn)
S5  SW-PB  [mom-sw]  (value not drawn)
S6  SW-PB  [mom-sw]  (value not drawn)
S7  SW-PB  [mom-sw]  (value not drawn)
S8  SW-PB  [mom-sw]  (value not drawn)
S9  SW-PB  [mom-sw]  (value not drawn)
S10  SW-PB  [mom-sw]  (value not drawn)
S11  SW-PB  [mom-sw]  (value not drawn)
S12  SW-PB  [mom-sw]  (value not drawn)
S13  SW-PB  [mom-sw]  (value not drawn)
S14  SW-PB  [mom-sw]  (value not drawn)
S15  SW-PB  [mom-sw]  (value not drawn)
S16  SW-PB  [mom-sw]  (value not drawn)
S17  SW DIP-2  [DIP-4]
SPEAKER-1  Speaker  [SPEAKER 2.5X1.5]
SW1  SW-PB  [SW-4PIN]  (value not drawn)
SW2  SW-PB  [SW-4PIN]  (value not drawn)
SW3  SW-PB  [SW-4PIN]  (value not drawn)
SW4  SW-PB  [SW-4PIN]  (value not drawn)
TP1  STAGE1  [TP]  (no BOM)
TP2  STAGE2  [TP]  (no BOM)
TP3  STAGE3  [TP]  (no BOM)
U17  M24C02MN6  [SOP8_N]
U18  DS1307Z  [SOIC8N_N]
U19  LM358AM  [M08A_N]  (part A of 2)
U20  LM35CZ  [Z03A]
U21  8002  [D008_M]
U22  LMV358D  [SO8_N]  (parts A,B of 2)
X-2  XTAL  [R38]

### Blocks framed on the sheet
Matrix KeyPad: R74#2 R76#2 R79 R81 R83-R86 S1-S16
Basic Switches: R75#2 R77#2 R78 R80 R82 RESET1 SW1-SW4
Real Time Clock - RTC: BT1 C40 U18 X-2
Basic ADC: C39 POT3 R87#2
Inferared Sensor: IR-R1 IR-T1 R88 R89 S17 U19
Basic LEDs: D23-D26 R90 R91 R94 R99
AUDIO LPF & Amplifier: C41 C43-C49 R93 R95-R98 R100-R103 SPEAKER-1 TP1-TP3 U21 U22

### Nets
+3V3: D23.1(A) D24.1(A) D25.1(A) D26.1(A) M4.1(VCC) R77#2.2 SW1.2 SW2.2 SW3.2 SW4.2 U17.1(E0) U17.8(VCC)
+5V: C48.1 C49.1 IR-R1.1(A) IR-T1.2(K) POT3.2(BOT) R98.2 U18.8(VCC) U19.8(V+) U20.3(+VS) U21.6(VDD) U22.8(V+)
GND: BT1.2(-) C39.1 C40.2 C41.1 C42.2 C45.1 C46.1 C47.1 C48.2 C49.2 M4.3(GND) POT3.1(TOP) R75#2.1 R78.1 R80.1 R82.1 R88.1 R101.1 R102.1 RESET1.2 U17.2(E1) U17.3(E2) U17.4(GND) U17.7(~{WC}) U18.4(GND) U19.4(GND) U20.1(GND) U21.1(SHD) U21.7(GND) U22.4(V-)
ADC_LEVEL: C39.2 R87#2.1 U19.2(IN-)
ADC_MIC: M4.2(OUT)
DATA8: R74#2.1
DATA9: R76#2.1
DATA10: R79.1
DATA11: R81.1
DATA12: R83.1
DATA13: R84.1
DATA14: R85.1
DATA15: R86.1
IR-INPUT: S17.4(B1) U19.1(OUT)
IR-OUT: R89.1 S17.3(B2)
LED-BLUE: R94.1 S17.1(A1)
LED-GREEN: R91.1 S17.2(A2)
LED-RED: R90.1
LED-YELLOW: R99.1
LM35-OUT: R92.2 U20.2(VOUT)
PB1+ETH_INT: R75#2.2 SW1.1
PB2: R78.2 SW2.1
PB3: R80.2 SW3.1
PB4: R82.2 SW4.1
PWM-SP: R95.1
RESET: R77#2.1 RESET1.1
SCL: U17.6(SCL)
SCL-TTL: U18.6(SCL)
SDA: U17.5(SDA)
SDA-TTL: U18.5(SDA)
SP+: SPEAKER-1.1 U21.8(VO2)
SP-: R103.1 SPEAKER-1.2 U21.5(CO1)
NetBT1_1: BT1.1(+) C40.1 U18.3(VBAT)
NetC41_2: C41.2 U21.2(BYPASS) U21.3(IN+)
NetC42_1: C42.1 R92.1
NetC43_1: C43.1 R100.2 TP3.1
NetC43_2: C43.2 R93.1 U22.1(OUT)
NetC44_1: C44.1 R98.1 R102.2 U22.3(IN+)
NetC44_2: C44.2 TP2.1 U22.6(IN-) U22.7(OUT)
NetC45_2: C45.2 R95.2 R96.1
NetC46_2: C46.2 R96.2 R97.1
NetC47_2: C47.2 R97.2 TP1.1 U22.5(IN+)
NetD23_2: D23.2(K) R90.2
NetD24_2: D24.2(K) R91.2
NetD25_2: D25.2(K) R94.2
NetD26_2: D26.2(K) R99.2
NetIR-R1_2: IR-R1.2(K) R88.2 U19.3(IN+)
NetIR-T1_1: IR-T1.1(A) R89.2
NetPOT3_3: POT3.3(TAP) R87#2.2
NetR74#2_2: R74#2.2 S1.1 S2.1 S3.1 S4.1
NetR76#2_2: R76#2.2 S5.1 S6.1 S7.1 S8.1
NetR79_2: R79.2 S9.1 S10.1 S11.1 S12.1
NetR81_2: R81.2 S13.1 S14.1 S15.1 S16.1
NetR83_2: R83.2 S1.2 S5.2 S9.2 S13.2
NetR84_2: R84.2 S2.2 S6.2 S10.2 S14.2
NetR85_2: R85.2 S3.2 S7.2 S11.2 S15.2
NetR86_2: R86.2 S4.2 S8.2 S12.2 S16.2
NetR93_2: R93.2 R101.2 U22.2(IN-)
NetR100_1: R100.1 R103.2 U21.4(IN-)
NetU18_1: U18.1(X1) X-2.2(OSC2)
NetU18_2: U18.2(X2) X-2.1(OSC1)

Not connected (* = marked no-connect by the designer): U18 7(SQW/OUT)

### Notes on the sheet
- (near M4) Audio Input
- EEPROM
- - Four Basic Single mom-Switch
  - a Reset switch
- I2C EEPROM
- Mic with pre-amplifier stage (MAX4466) as audio input
- (near U18) DS1307 is Real Time Clock IC which work with 5V power supply , using a voltage translator we can read it at 0x68 address using I2C
- Using two V-SYNC and H-SYNC can generate proper timing for a VGA display , just note that in because of using one bit per color , we just can show 8 main color on the display
- LM35 - Temperature Sensor
- LM35CZ is a temerature IC with analog output. it work with 5V power supply and The sensitivity of LM35 is 10 mV/degree Celsius
- (in symbol LM358D, part A) A
- (in symbol LM358D, part B) B

### Library data of the parts
BT1 = Battery: Multicell Battery; Published: 24-Mar-1999; LatestRevisionDate: 17-Jul-2002; LatestRevisionNote: Re-released for DXP Platform.; PackageReference: BAT-2; Publisher: Altium Limited
C39 C41 C43-C48 = Cap: Capacitor; Published: 8-Jun-2000; LatestRevisionDate: 17-Jul-2002; LatestRevisionNote: Re-released for DXP Platform.; PackageReference: RAD-0.3; Publisher: Altium Limited
  C39: Value: 10nF
  C41: PackageDescription: Radial Cap, Thru-Hole; 2 Leads; 0.3 in Pin Spacing; Value: 1uF
  C43 C44 C48: PackageDescription: Radial Cap, Thru-Hole; 2 Leads; 0.3 in Pin Spacing; Value: 2.2uF
  C45-C47: PackageDescription: Radial Cap, Thru-Hole; 2 Leads; 0.3 in Pin Spacing; Value: 1nF
C40 = Cap Pol1: Polarized Capacitor (Radial); Value: 2.2uF; Published: 8-Jun-2000; LatestRevisionDate: 17-Jul-2002; LatestRevisionNote: Re-released for DXP Platform.; PackageReference: RB7.6-15; Publisher: Altium Limited
C42 C49 = Cap Pol1: Polarized Capacitor (Radial); Published: 8-Jun-2000; LatestRevisionDate: 17-Jul-2002; LatestRevisionNote: Re-released for DXP Platform.; PackageReference: RB7.6-15; Publisher: Altium Limited
  C42: Value: 1uF
  C49: PackageDescription: Polarized Capacitor (Radial); 2 Leads; Value: 10uF
D23-D26 IR-R1 IR-T1 = LED0: Typical INFRARED GaAs LED; Published: 8-Jun-2000; LatestRevisionDate: 08-Jul-2005; LatestRevisionNote: Mech Layer 1 removed.; PackageReference: LED-0; Publisher: Altium Limited
M4 = MIC-MAX4466: Electret Microphone Amplifier
POT3 = RPot: Potentiometer; Sim Note: Enter the Resistance value and the set point into parameter fields.; Set Position: 0.5; Published: 8-Jun-2000; LatestRevisionDate: 17-Jul-2002; LatestRevisionNote: Re-released for DXP Platform.; PackageReference: VR5; Publisher: Altium Limited
R74#2 R75#2 R76#2 R77#2 R78-R86 R87#2 R88-R103 = Res1: Resistor; Published: 8-Jun-2000; LatestRevisionDate: 17-Jul-2002; LatestRevisionNote: Re-released for DXP Platform.; PackageReference: AXIAL-0.3; Publisher: Altium Limited
  R74#2 R76#2 R79 R81 R83-R86: Value: 470
  R75#2 R77#2 R78 R80 R82 R88: Value: 10K
  R87#2: Value: 15K
  R89: Value: 100
  R90 R91 R94 R99: Value: 220
  R92: Value: 75
  R93: PackageDescription: Axial Device, Thru-Hole; 2 Leads; 0.3 in Pin Spacing; Value: 1K
  R95-R97: PackageDescription: Axial Device, Thru-Hole; 2 Leads; 0.3 in Pin Spacing; Value: 15K
  R98: PackageDescription: Axial Device, Thru-Hole; 2 Leads; 0.3 in Pin Spacing; Value: 4.7K
  R100 R103: PackageDescription: Axial Device, Thru-Hole; 2 Leads; 0.3 in Pin Spacing; Value: 3.3K
  R101: PackageDescription: Axial Device, Thru-Hole; 2 Leads; 0.3 in Pin Spacing; Value: 10K
  R102: PackageDescription: Axial Device, Thru-Hole; 2 Leads; 0.3 in Pin Spacing; Value: 2.2K
RESET1 S1-S16 SW1-SW4 = SW-PB: Switch; Published: 24-Mar-1999; LatestRevisionDate: 17-Jul-2002; LatestRevisionNote: Re-released for DXP Platform.; PackageReference: SPST-2; Publisher: Altium Limited
S17 = SW DIP-2: DIP Switch, 2 Position, SPST; Published: 24-Mar-1999; LatestRevisionDate: 17-Jul-2002; LatestRevisionNote: Re-released for DXP Platform.; PackageReference: DIP-4; Publisher: Altium Limited
SPEAKER-1 = Speaker: Loudspeaker; pin to pad: 1>2 2>1; Published: 24-Mar-1999; LatestRevisionDate: 17-Jul-2002; LatestRevisionNote: Re-released for DXP Platform.; PackageReference: PIN2; Publisher: Altium Limited
TP1-TP3 = Socket: LatestRevisionDate: 17-Jul-2002; LatestRevisionNote: Re-released for DXP Platform.; Publisher: Altium Limited
U17 = M24C02MN6: 2Kbit Serial I²C Bus EEPROM; Published: 24-Aug-2001; LatestRevisionDate: 13-Apr-2006; LatestRevisionNote: IPC-7351 Footprint Added.; DatasheetVersion: Sep-1999; PackageVersion: Jul-1999; PackageReference: SOP8; Publisher: Altium Limited; PackageDescription: 8-Pin Small Outline Integrated Circuit 1.27 mm Pitch; ComponentLink1Description: Manufacturer Link; ComponentLink1URL: http://www.st.com/; ComponentLink2Description: Datasheet; ComponentLink2URL: http://www.st.com/stonline/products/literature/ds/5067/m24c01-r.pdf
U18 = DS1307Z: 64 X 8 Serial Real-Time Clock; Published: 13-Oct-2000; LatestRevisionDate: 13-Apr-2006; LatestRevisionNote: IPC-7351 Footprint Added.; DatasheetVersion: 10-Aug-1999; PackageVersion: 1999; PackageReference: SOIC8N; Publisher: Altium Limited; PackageDescription: 8-Pin Small Outline Integrated Circuit 1.27 mm Pitch; Code_IPC: SOIC127P600-8; ComponentLink1Description: Manufacturer Link; ComponentLink1URL: http://www.maxim-ic.com/; ComponentLink2Description: Datasheet; ComponentLink2URL: http://pdfserv.maxim-ic.com/en/ds/DS1307.pdf; ComponentLink3Description: Discontinuation Notice; ComponentLink3URL: http://www.maxim-ic.com/qa/pdfs/non-obsolescence-letter.pdf
U19 = LM358AM: Low-Power Dual Operational Amplifier; Published: 15-Apr-2002; LatestRevisionDate: 13-Apr-2006; LatestRevisionNote: IPC-7351 Footprint Added.; DatasheetVersion: Sep-1999; PackageVersion: Sep-1997; PackageReference: M08A; Publisher: Altium Limited; PackageDescription: 8-Pin Small Outline Integrated Circuit 1.27 mm Pitch; Code_JEDEC: MS-012-AA; Code_IPC: SOIC127P600-8; ComponentLink1Description: Manufacturer Link; ComponentLink1URL: http://www.national.com/; ComponentLink2Description: Datasheet; ComponentLink2URL: http://www.national.com/ds.cgi/LM/LM158.pdf; ComponentLink3Description: URL Link1; ComponentLink3URL: http://www.national.com/pf/LM/LM358.html
U20 = LM35CZ: Precision CentigradeTemperature Sensor; Published: 15-Apr-2002; DatasheetVersion: Sep-1997; PackageVersion: 2000; PackageReference: Z03A; Publisher: Altium Limited; PackageDescription: TO, Flat Index; 3 In-Line, Axial Leads; Body Dia. 4.6mm; Leads 0.53 x 0.39 mm (max); ComponentLink1Description: Manufacturer Link; ComponentLink1URL: http://www.national.com/; ComponentLink2Description: Datasheet; ComponentLink2URL: http://www.national.com/ds.cgi/LM/LM35.pdf; ComponentLink3Description: URL Link1; ComponentLink3URL: http://www.national.com/pf/LM/LM35.html
U21 = 8002: 8002  Class-AB audio power amplifier
U22 = LM358D: Dual Low-Power Operational Amplifier; Published: 24-Aug-2001; LatestRevisionDate: 13-Apr-2006; LatestRevisionNote: IPC-7351 Footprint Added.; PackageVersion: Dec-2002; PackageReference: SO8; Publisher: Altium Limited; PackageDescription: 8-Pin Small Outline Integrated Circuit 1.27 mm Pitch; Code_JEDEC: MS-012-AA; Code_IPC: SOIC127P600-8; ComponentLink1Description: Manufacturer Link; ComponentLink1URL: http://www.st.com/; ComponentLink2Description: Datasheet; ComponentLink2URL: http://www.st.com/stonline/products/literature/ds/2163/lm358.pdf
X-2 = XTAL: Crystal Oscillator; Published: 8-Jun-2000; LatestRevisionDate: 17-Jul-2002; LatestRevisionNote: Re-released for DXP Platform.; PackageReference: R38; Publisher: Altium Limited